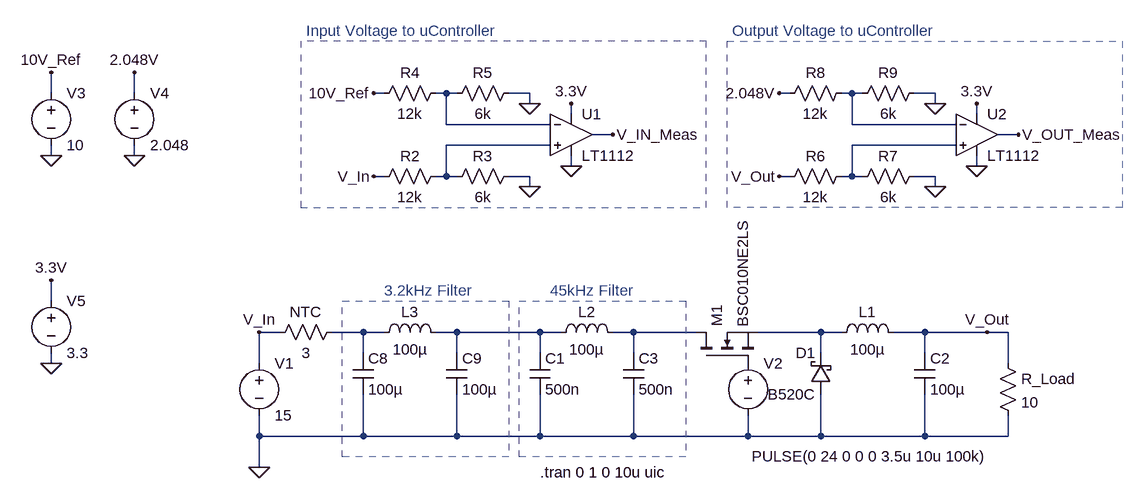
[diagram p0: schematic BuckConvModel.asc]
BuckConvModel.asc, the LTspice schematic file:
Version 4
SHEET 1 1424 680
WIRE -800 -256 -800 -288
WIRE -672 -256 -672 -288
WIRE -288 -256 -304 -256
WIRE -192 -256 -208 -256
WIRE -176 -256 -192 -256
WIRE -64 -256 -96 -256
WIRE 336 -256 320 -256
WIRE 432 -256 416 -256
WIRE 448 -256 432 -256
WIRE 560 -256 528 -256
WIRE -64 -240 -64 -256
WIRE 560 -240 560 -256
WIRE 0 -224 0 -240
WIRE 624 -224 624 -240
WIRE -192 -208 -192 -256
WIRE -32 -208 -192 -208
WIRE 432 -208 432 -256
WIRE 592 -208 432 -208
WIRE 64 -192 32 -192
WIRE 688 -192 656 -192
WIRE -32 -176 -192 -176
WIRE 592 -176 432 -176
WIRE -800 -160 -800 -176
WIRE -672 -160 -672 -176
WIRE 0 -144 0 -160
WIRE 624 -144 624 -160
WIRE -288 -128 -304 -128
WIRE -192 -128 -192 -176
WIRE -192 -128 -208 -128
WIRE -176 -128 -192 -128
WIRE -64 -128 -96 -128
WIRE 336 -128 320 -128
WIRE 432 -128 432 -176
WIRE 432 -128 416 -128
WIRE 448 -128 432 -128
WIRE 560 -128 528 -128
WIRE -64 -112 -64 -128
WIRE 560 -112 560 -128
WIRE -800 64 -800 32
WIRE -448 112 -480 112
WIRE -320 112 -368 112
WIRE -288 112 -320 112
WIRE -176 112 -208 112
WIRE -48 112 -176 112
WIRE -16 112 -48 112
WIRE 96 112 64 112
WIRE 192 112 96 112
WIRE 384 112 288 112
WIRE 416 112 384 112
WIRE 544 112 496 112
WIRE 640 112 544 112
WIRE 672 112 640 112
WIRE -320 144 -320 112
WIRE -176 144 -176 112
WIRE -48 144 -48 112
WIRE 96 144 96 112
WIRE 384 144 384 112
WIRE 544 144 544 112
WIRE -800 160 -800 144
WIRE -480 160 -480 112
WIRE 672 160 672 112
WIRE -480 272 -480 240
WIRE -320 272 -320 208
WIRE -320 272 -480 272
WIRE -176 272 -176 208
WIRE -176 272 -320 272
WIRE -48 272 -48 208
WIRE -48 272 -176 272
WIRE 96 272 96 208
WIRE 96 272 -48 272
WIRE 272 272 272 240
WIRE 272 272 96 272
WIRE 384 272 384 208
WIRE 384 272 272 272
WIRE 544 272 544 208
WIRE 544 272 384 272
WIRE 672 272 672 240
WIRE 672 272 544 272
WIRE -480 320 -480 272
FLAG -480 320 0
FLAG 640 112 V_Out
FLAG 0 -144 0
FLAG 0 -240 3.3V
FLAG -64 -112 0
FLAG -480 112 V_In
FLAG -304 -128 V_In
FLAG -64 -240 0
FLAG -304 -256 10V_Ref
FLAG 624 -144 0
FLAG 624 -240 3.3V
FLAG 560 -112 0
FLAG 320 -128 V_Out
FLAG 560 -240 0
FLAG 320 -256 2.048V
FLAG 64 -192 V_IN_Meas
FLAG 688 -192 V_OUT_Meas
FLAG -800 -160 0
FLAG -800 -288 10V_Ref
FLAG -672 -160 0
FLAG -672 -288 2.048V
FLAG -800 160 0
FLAG -800 32 3.3V
SYMBOL voltage -480 144 R0
WINDOW 123 0 0 Left 0
WINDOW 39 0 0 Left 0
SYMATTR InstName V1
SYMATTR Value 15
SYMBOL cap -64 144 R0
SYMATTR InstName C1
SYMATTR Value 500n
SYMATTR SpiceLine Rser=1.2
SYMBOL ind 400 128 R270
WINDOW 0 32 56 VTop 2
WINDOW 3 5 56 VBottom 2
SYMATTR InstName L1
SYMATTR Value 100µ
SYMATTR SpiceLine Rser=0.079
SYMBOL schottky 400 208 R180
WINDOW 0 24 64 Left 2
WINDOW 3 24 0 Left 2
SYMATTR InstName D1
SYMATTR Value B520C
SYMATTR Description Diode
SYMATTR Type diode
SYMBOL res 656 144 R0
SYMATTR InstName R_Load
SYMATTR Value 10
SYMBOL cap 528 144 R0
SYMATTR InstName C2
SYMATTR Value 100µ
SYMATTR SpiceLine Rser=0.7
SYMBOL voltage 272 144 R0
WINDOW 3 6 159 Left 2
WINDOW 123 0 0 Left 0
WINDOW 39 0 0 Left 0
SYMATTR Value PULSE(0 24 0 0 0 3.5u 10u 100k)
SYMATTR InstName V2
SYMBOL nmos 192 160 R270
SYMATTR InstName M1
SYMATTR Value BSC010NE2LS
SYMBOL ind -32 128 R270
WINDOW 0 32 56 VTop 2
WINDOW 3 5 56 VBottom 2
SYMATTR InstName L2
SYMATTR Value 100µ
SYMBOL cap 80 144 R0
SYMATTR InstName C3
SYMATTR Value 500n
SYMBOL ind -304 128 R270
WINDOW 0 32 56 VTop 2
WINDOW 3 5 56 VBottom 2
SYMATTR InstName L3
SYMATTR Value 100µ
SYMBOL cap -336 144 R0
SYMATTR InstName C8
SYMATTR Value 100µ
SYMATTR SpiceLine Rser=1.2
SYMBOL cap -192 144 R0
SYMATTR InstName C9
SYMATTR Value 100µ
SYMBOL res -352 96 R90
WINDOW 0 0 56 VBottom 2
WINDOW 3 32 56 VTop 2
SYMATTR InstName NTC
SYMATTR Value 3
SYMBOL OpAmps\\LT1112 0 -256 R0
SYMATTR InstName U1
SYMBOL res -192 -144 R90
WINDOW 0 0 56 VBottom 2
WINDOW 3 32 56 VTop 2
SYMATTR InstName R2
SYMATTR Value 12k
SYMBOL res -80 -144 R90
WINDOW 0 0 56 VBottom 2
WINDOW 3 32 56 VTop 2
SYMATTR InstName R3
SYMATTR Value 6k
SYMBOL res -192 -272 R90
WINDOW 0 0 56 VBottom 2
WINDOW 3 32 56 VTop 2
SYMATTR InstName R4
SYMATTR Value 12k
SYMBOL res -80 -272 R90
WINDOW 0 0 56 VBottom 2
WINDOW 3 32 56 VTop 2
SYMATTR InstName R5
SYMATTR Value 6k
SYMBOL OpAmps\\LT1112 624 -256 R0
SYMATTR InstName U2
SYMBOL res 432 -144 R90
WINDOW 0 0 56 VBottom 2
WINDOW 3 32 56 VTop 2
SYMATTR InstName R6
SYMATTR Value 12k
SYMBOL res 544 -144 R90
WINDOW 0 0 56 VBottom 2
WINDOW 3 32 56 VTop 2
SYMATTR InstName R7
SYMATTR Value 6k
SYMBOL res 432 -272 R90
WINDOW 0 0 56 VBottom 2
WINDOW 3 32 56 VTop 2
SYMATTR InstName R8
SYMATTR Value 12k
SYMBOL res 544 -272 R90
WINDOW 0 0 56 VBottom 2
WINDOW 3 32 56 VTop 2
SYMATTR InstName R9
SYMATTR Value 6k
SYMBOL voltage -800 -272 R0
SYMATTR InstName V3
SYMATTR Value 10
SYMBOL voltage -672 -272 R0
SYMATTR InstName V4
SYMATTR Value 2.048
SYMBOL voltage -800 48 R0
SYMATTR InstName V5
SYMATTR Value 3.3
TEXT -48 328 Left 2 !.tran 0 1 0 10u uic
TEXT -32 48 Left 2 ;45kHz Filter
TEXT -288 48 Left 2 ;3.2kHz Filter
TEXT -408 -352 Left 2 ;Input Voltage to uController
TEXT 248 -352 Left 2 ;Output Voltage to uController
RECTANGLE Normal -96 304 -352 64 2
RECTANGLE Normal 848 -80 240 -336 2
RECTANGLE Normal -416 -80 208 -336 2
RECTANGLE Normal 176 304 -80 64 2

The netlist it stands for:
* BuckConvModel.asc
V1 V_In 0 15
C1 N006 0 500n Rser=1.2
L1 N008 V_Out 100µ Rser=0.079
D1 0 N008 B520C
R_Load V_Out 0 10
C2 V_Out 0 100µ Rser=0.7
V2 P001 0 PULSE(0 24 0 0 0 3.5u 10u 100k)
M1 N007 P001 N008 N008 BSC010NE2LS
L2 N006 N007 100µ
C3 N007 0 500n
L3 N005 N006 100µ
C8 N005 0 100µ Rser=1.2
C9 N006 0 100µ
R§NTC N005 V_In 3
XU1 N003 N001 3.3V 0 V_IN_Meas LT1112  ; pins In+ In- V+ V- OUT
R2 N003 V_In 12k
R3 0 N003 6k
R4 N001 10V_Ref 12k
R5 0 N001 6k
XU2 N004 N002 3.3V 0 V_OUT_Meas LT1112  ; pins In+ In- V+ V- OUT
R6 N004 V_Out 12k
R7 0 N004 6k
R8 N002 2.048V 12k
R9 0 N002 6k
V3 10V_Ref 0 10
V4 2.048V 0 2.048
V5 3.3V 0 3.3
.model D D
.lib standard.dio
.model NMOS NMOS
.model PMOS PMOS
.lib standard.mos
.tran 0 1 0 10u uic
* 45kHz Filter
* 3.2kHz Filter
* Input Voltage to uController
* Output Voltage to uController
.lib LTC.lib
.backanno
.end